# EAGLE design v1.3SMD (EAGLE 7.4.0)
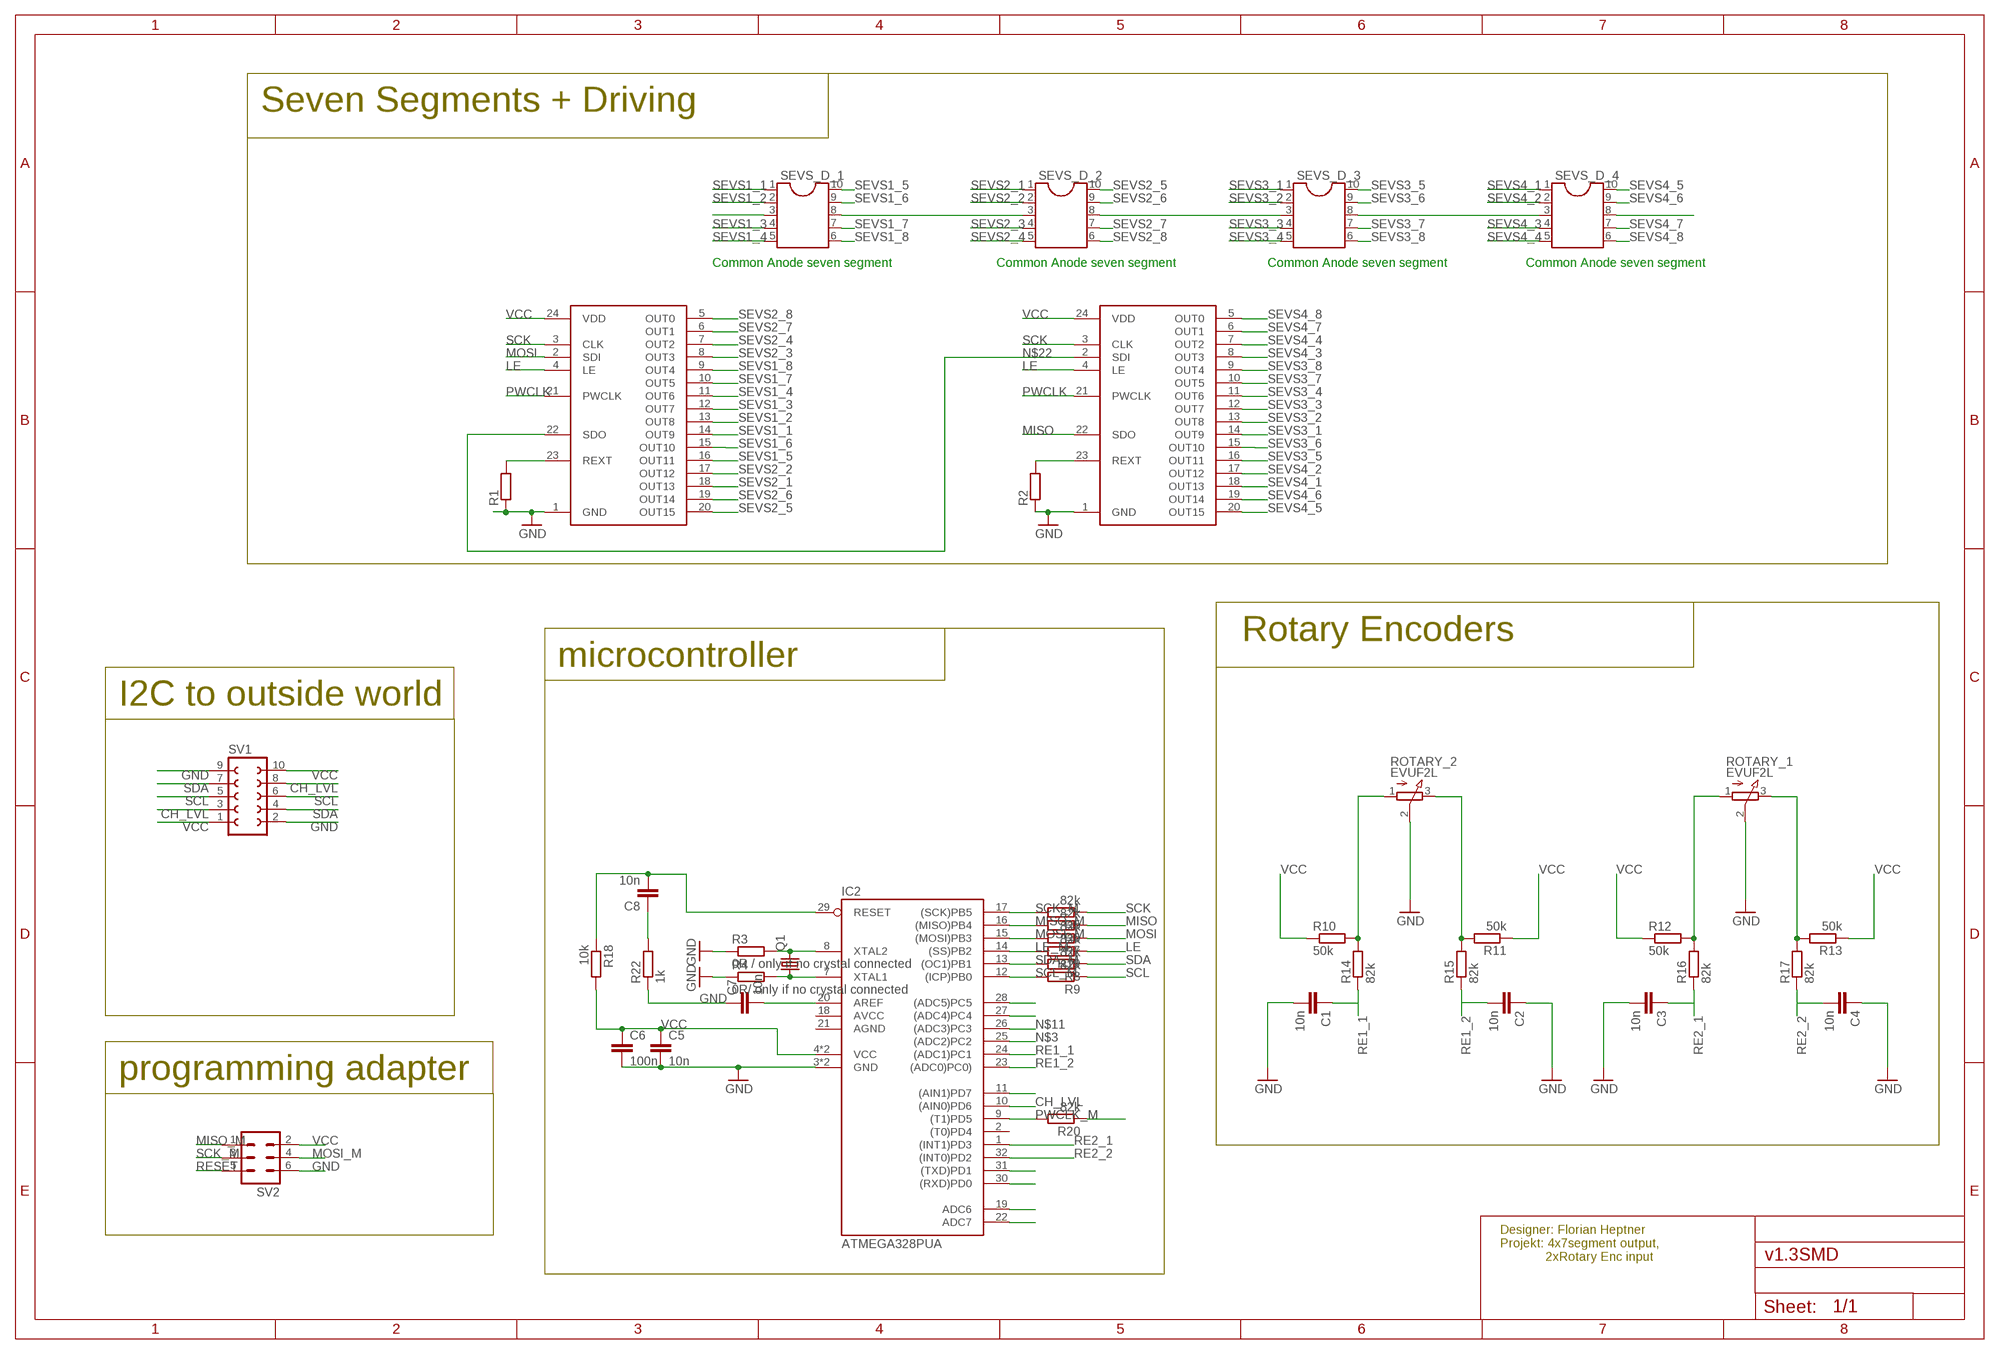
[diagram p0: schematic, sheet 1]

## Parts
C1  10n  C-EUC0603  [C0603]
C2  10n  C-EUC0603  [C0603]
C3  10n  C-EUC0603  [C0603]
C4  10n  C-EUC0603  [C0603]
C5  10n  C-EUC0603  [C0603]
C6  100n  C-EUC0603  [C0603]
C7  10n  C-EUC0603  [C0603]
C8  10n  C-EUC0603  [C0603]
IC2  ATMEGA328PUA  [TQFP32-08]
Q1  CRYSTALSM49  [SM49]
R1  R-EU_R0603  [R0603]
R2  R-EU_R0603  [R0603]
R3  0R / only if no crystal connected  R-EU_R0603  [R0603]
R4  0R/ only if no crystal connected  R-EU_R0603  [R0603]
R5  82k  R-EU_R0603  [R0603]
R6  82k  R-EU_R0603  [R0603]
R7  82k  R-EU_R0603  [R0603]
R8  82k  R-EU_R0603  [R0603]
R9  82k  R-EU_R0603  [R0603]
R10  50k  R-EU_R0603  [R0603]
R11  50k  R-EU_R0603  [R0603]
R12  50k  R-EU_R0603  [R0603]
R13  50k  R-EU_R0603  [R0603]
R14  82k  R-EU_R0603  [R0603]
R15  82k  R-EU_R0603  [R0603]
R16  82k  R-EU_R0603  [R0603]
R17  82k  R-EU_R0603  [R0603]
R18  10k  R-EU_R0603  [R0603]
R19  82k  R-EU_R0603  [R0603]
R20  82k  R-EU_R0603  [R0603]
R22  1k  R-EU_R0603  [R0603]
ROTARY_1  EVUF2L  [EVUFXL]
ROTARY_2  EVUF2L  [EVUFXL]
SEVS_D_1  DIL10  [DIL10]
SEVS_D_2  DIL10  [DIL10]
SEVS_D_3  DIL10  [DIL10]
SEVS_D_4  DIL10  [DIL10]
SV1  FE05-2  [FE05-2]
SV2  ML6  [ML6]
U$1  SPILEDDRIVER  [TSSOP24]
U$2  SPILEDDRIVER  [TSSOP24]

## Nets
CH_LVL: IC2.10((AIN0)PD6) SV1.3 SV1.8
GND: C1.2 C2.1 C3.2 C4.1 C5.2 C6.2 C7.1 IC2.3(GND) IC2.5(GND) R1.1 R2.1 R3.1 R4.1 R22.1 ROTARY_1.2(S) ROTARY_2.2(S) SV1.2 SV1.9 SV2.6 U$1.1(GND) U$2.1(GND)
LE: R19.1 U$1.4(LE) U$2.4(LE)
LE_M: IC2.14((SS)PB2) R19.2
MISO: R6.1 U$2.22(SDO)
MISO_M: IC2.16((MISO)PB4) R6.2 SV2.1
MOSI: R7.1 U$1.2(SDI)
MOSI_M: IC2.15((MOSI)PB3) R7.2 SV2.4
N$1: R11.2 R15.2 ROTARY_2.3(E)
N$2: C8.1 R22.2
N$3: IC2.25((ADC2)PC2)
N$4: R10.2 R14.2 ROTARY_2.1(A)
N$5: R12.2 R16.2 ROTARY_1.1(A)
N$6: R13.2 R17.2 ROTARY_1.3(E)
N$7: IC2.7(XTAL1) Q1.1 R4.2
N$8: IC2.8(XTAL2) Q1.2 R3.2
N$10: IC2.28((ADC5)PC5)
N$11: IC2.26((ADC3)PC3)
N$12: IC2.27((ADC4)PC4)
N$13: IC2.11((AIN1)PD7)
N$15: C7.2 IC2.20(AREF)
N$17: IC2.31((TXD)PD1)
N$18: IC2.30((RXD)PD0)
N$19: IC2.19(ADC6)
N$20: IC2.22(ADC7)
N$22: U$1.22(SDO) U$2.2(SDI)
N$42: R1.2 U$1.23(REXT)
N$44: R2.2 U$2.23(REXT)
PWCLK: R20.1 U$1.21(PWCLK) U$2.21(PWCLK)
PWCLK_M: IC2.9((T1)PD5) R20.2
RE1_1: C1.1 IC2.24((ADC1)PC1) R14.1
RE1_2: C2.2 IC2.23((ADC0)PC0)) R15.1
RE2_1: C3.1 IC2.1((INT1)PD3) R16.1
RE2_2: C4.2 IC2.32((INT0)PD2) R17.1
RESET: C8.2 IC2.29(RESET) R18.1 SV2.5
SCK: R5.1 U$1.3(CLK) U$2.3(CLK)
SCK_M: IC2.17((SCK)PB5) R5.2 SV2.3
SCL: R9.1 SV1.5 SV1.6
SCL_M: IC2.12((ICP)PB0) R9.2
SDA: R8.1 SV1.4 SV1.7
SDA_M: IC2.13((OC1)PB1) R8.2
SEVS1_1: SEVS_D_1.1 U$1.14(OUT9)
SEVS1_2: SEVS_D_1.2 U$1.13(OUT8)
SEVS1_3: SEVS_D_1.4 U$1.12(OUT7)
SEVS1_4: SEVS_D_1.5 U$1.11(OUT6)
SEVS1_5: SEVS_D_1.10 U$1.16(OUT11)
SEVS1_6: SEVS_D_1.9 U$1.15(OUT10)
SEVS1_7: SEVS_D_1.7 U$1.10(OUT5)
SEVS1_8: SEVS_D_1.6 U$1.9(OUT4)
SEVS2_1: SEVS_D_2.1 U$1.18(OUT13)
SEVS2_2: SEVS_D_2.2 U$1.17(OUT12)
SEVS2_3: SEVS_D_2.4 U$1.8(OUT3)
SEVS2_4: SEVS_D_2.5 U$1.7(OUT2)
SEVS2_5: SEVS_D_2.10 U$1.20(OUT15)
SEVS2_6: SEVS_D_2.9 U$1.19(OUT14)
SEVS2_7: SEVS_D_2.7 U$1.6(OUT1)
SEVS2_8: SEVS_D_2.6 U$1.5(OUT0)
SEVS3_1: SEVS_D_3.1 U$2.14(OUT9)
SEVS3_2: SEVS_D_3.2 U$2.13(OUT8)
SEVS3_3: SEVS_D_3.4 U$2.12(OUT7)
SEVS3_4: SEVS_D_3.5 U$2.11(OUT6)
SEVS3_5: SEVS_D_3.10 U$2.16(OUT11)
SEVS3_6: SEVS_D_3.9 U$2.15(OUT10)
SEVS3_7: SEVS_D_3.7 U$2.10(OUT5)
SEVS3_8: SEVS_D_3.6 U$2.9(OUT4)
SEVS4_1: SEVS_D_4.1 U$2.18(OUT13)
SEVS4_2: SEVS_D_4.2 U$2.17(OUT12)
SEVS4_3: SEVS_D_4.4 U$2.8(OUT3)
SEVS4_4: SEVS_D_4.5 U$2.7(OUT2)
SEVS4_5: SEVS_D_4.10 U$2.20(OUT15)
SEVS4_6: SEVS_D_4.9 U$2.19(OUT14)
SEVS4_7: SEVS_D_4.7 U$2.6(OUT1)
SEVS4_8: SEVS_D_4.6 U$2.5(OUT0)
VCC: C5.1 C6.1 IC2.4(VCC) IC2.6(VCC) R10.1 R11.1 R12.1 R13.1 R18.2 SEVS_D_1.3 SEVS_D_1.8 SEVS_D_2.3 SEVS_D_2.8 SEVS_D_3.3 SEVS_D_3.8 SEVS_D_4.3 SEVS_D_4.8 SV1.1 SV1.10 SV2.2 U$1.24(VDD) U$2.24(VDD)
Unconnected: IC2.2((T0)PD4)

## Notes on the sheet
- Seven Segments + Driving
- Common Anode seven segment | Common Anode seven segment | Common Anode seven segment | Common Anode seven segment
- Rotary Encoders
- microcontroller
- I2C to outside world
- programming adapter
- Designer: Florian Heptner
  Projekt: 4x7segment output,
               2xRotary Enc input

## Power pins joined to a net without a drawn wire
AGND: IC2.21(AGND)
AVCC: IC2.18(AVCC)

## Library data of the parts
C1-C8 = rcl:C-EU: CAPACITOR, European symbol
IC2 = atmel:ATMEGA328PU: MICROCONTROLLER 4 Kbytes FLASH 128 bytes SRAM 256 bytes EEPROM UART 6-channel 10 bit ADC; OC_FARNELL: unknown; OC_NEWARK: unknown
Q1 = crystal:CRYSTAL: CRYSTAL; OC_FARNELL: unknown; OC_NEWARK: unknown
R1-R20 R22 = rcl:R-EU_: RESISTOR, European symbol
ROTARY_1 ROTARY_2 = pot:EVU: 9 mm Square Rotary Potentiometers Source: Panasonic
SEVS_D_1-SEVS_D_4 = ic-package:DIL10: Dual In Line / Socket
SV1 = con-lsta:FE05-2: FEMALE HEADER; OC_FARNELL: unknown; OC_NEWARK: unknown
SV2 = con-harting-ml:ML6: HARTING; OC_FARNELL: unknown; OC_NEWARK: unknown
U$1 U$2 = spileddriver:SPILEDDRIVER

## Board
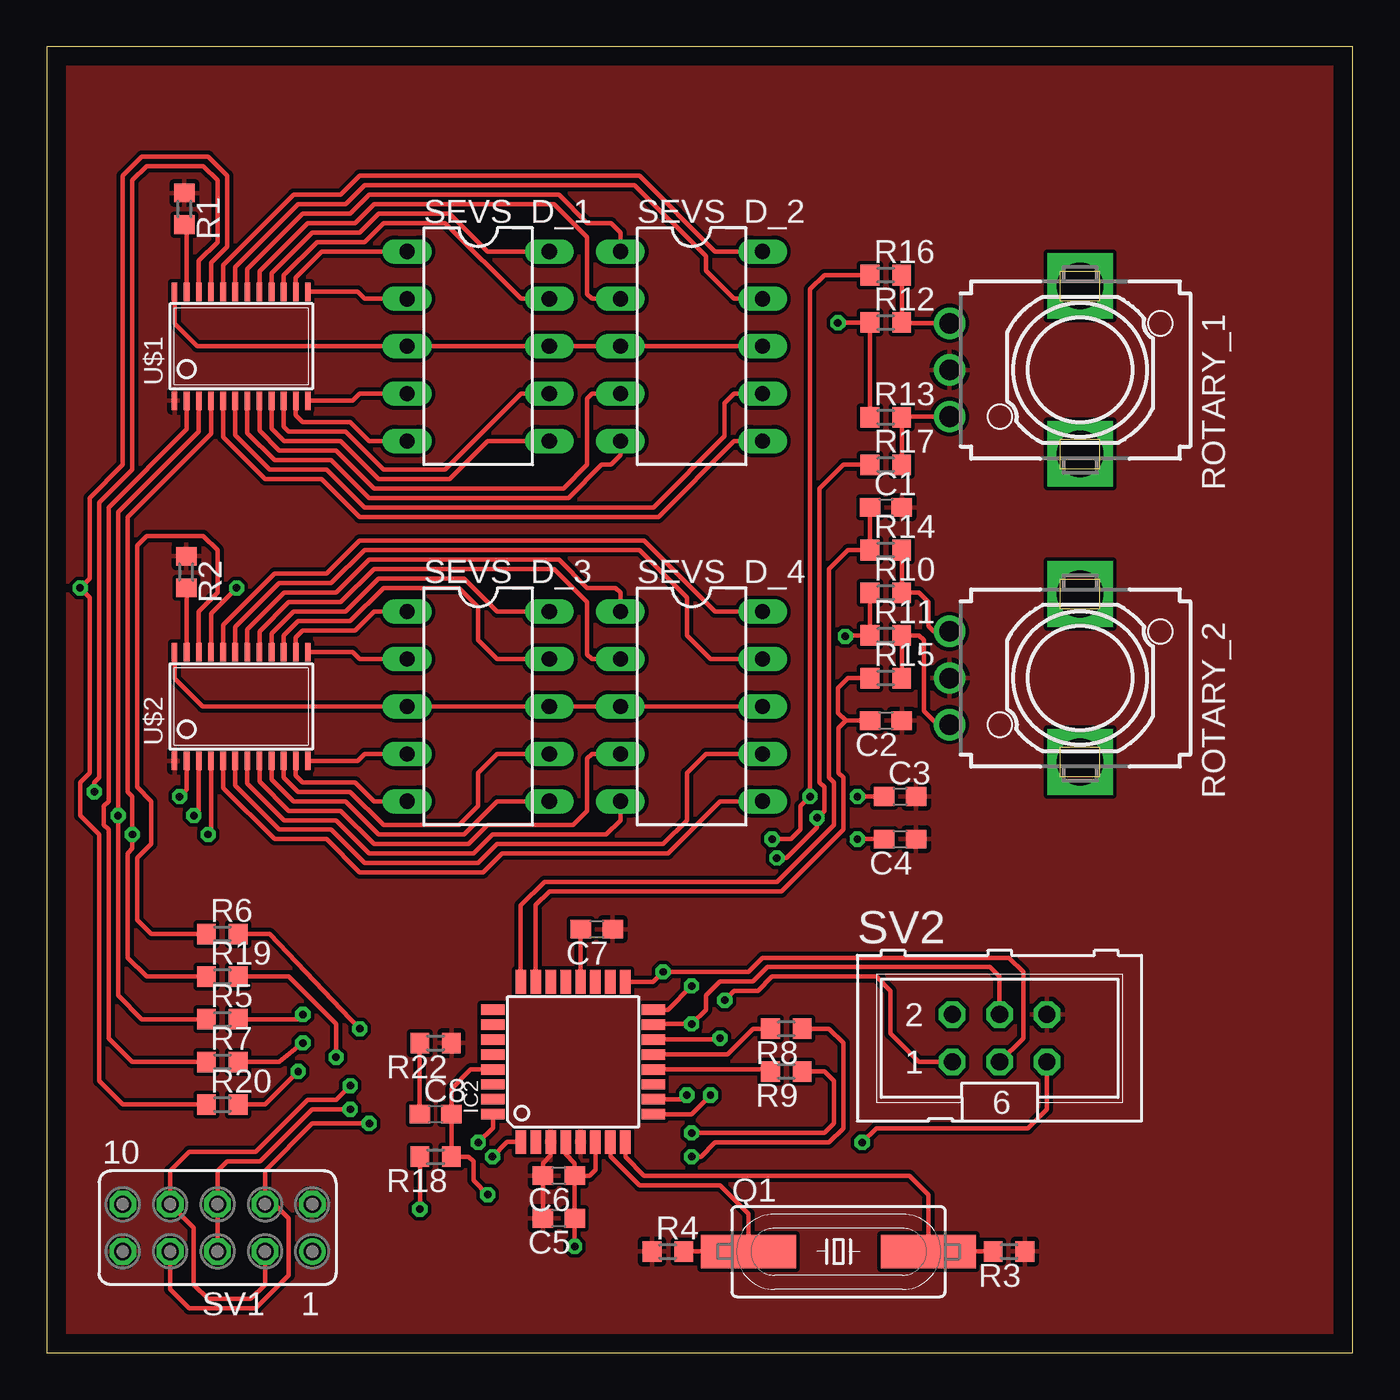
[diagram p1: board, top side]
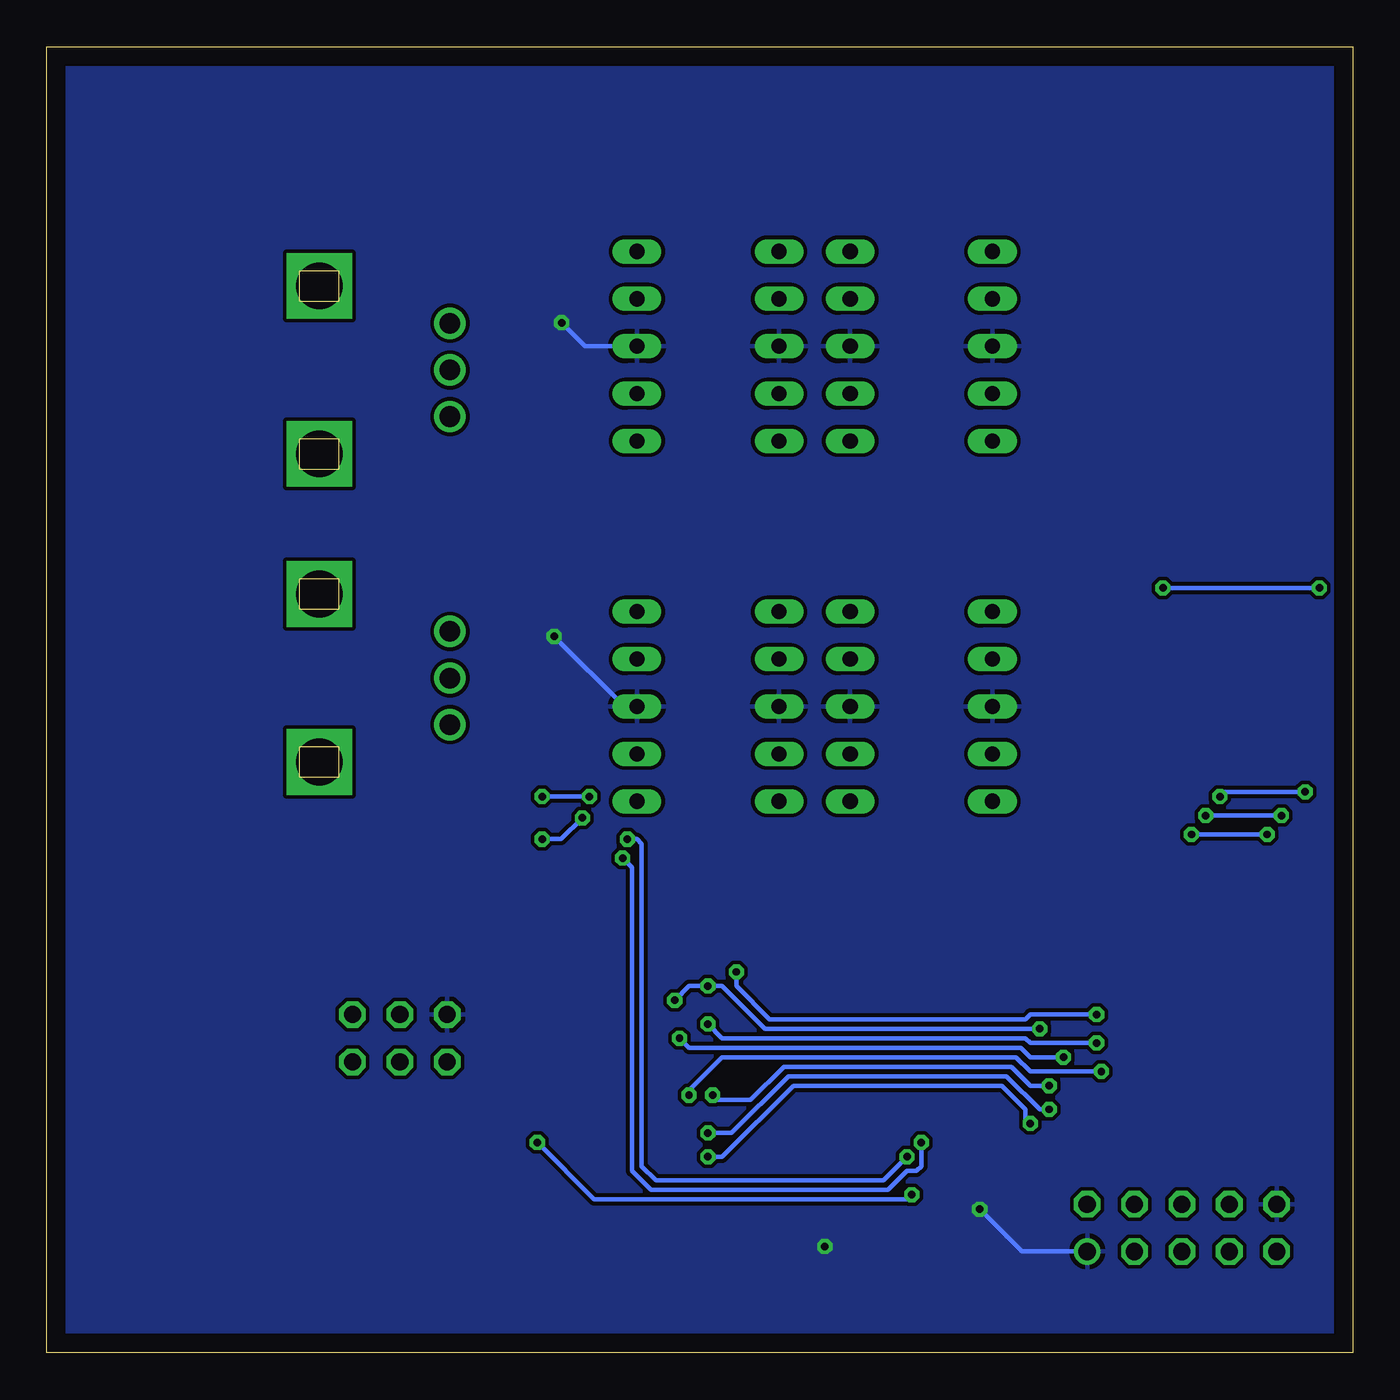
[diagram p2: board, bottom side, seen from below]

Size 70 x 70 mm. Coordinates in mm from the lower left corner, seen from the top.
Outline: 0,0 70,0 70,70 0,70 0,0
Copper layers (1*16): Top 0.035mm / dielectric 1.5mm / Bottom 0.035mm
Design rules "default *": minimum track width 10mil, minimum drill 0.3mm, track to track 8mil, track to pad 8mil, pad to pad 8mil, via to via 8mil, smd to smd 8mil, copper to edge 40mil, drill to drill 8mil, minimum pad ring 10mil, minimum via ring 8mil, stop-mask expansion 4mil, vias tented up to drill 0mil, thermal gap 10mil

### Footprints (pad centres in the part's own frame; a part is rotated, then mirrored left to right if it is on the bottom)
C0603 = smd 1.1 x 1: 1 -0.85,0; 2 0.85,0
TQFP32-08 = smd 1.27 x 0.559: 1 -4.293,2.8; 2 -4.293,2; 3 -4.293,1.2; 4 -4.293,0.4; 5 -4.293,-0.4; 6 -4.293,-1.2; 7 -4.293,-2; 8 -4.293,-2.8; 17 4.293,-2.8; 18 4.293,-2; 19 4.293,-1.2; 20 4.293,-0.4; 21 4.293,0.4; 22 4.293,1.2; 23 4.293,2; 24 4.293,2.8 | smd 0.559 x 1.27: 9 -2.8,-4.293; 10 -2,-4.293; 11 -1.2,-4.293; 12 -0.4,-4.293; 13 0.4,-4.293; 14 1.2,-4.293; 15 2,-4.293; 16 2.8,-4.293; 25 2.8,4.293; 26 2,4.293; 27 1.2,4.293; 28 0.4,4.293; 29 -0.4,4.293; 30 -1.2,4.293; 31 -2,4.293; 32 -2.8,4.293
SM49 = smd 5.08 x 1.778: 1 -4.826,0; 2 4.826,0
R0603 = smd 1 x 1.1: 1 -0.85,0; 2 0.85,0
EVUFXL = drill 1.1 pad 1.676: 1 -2.5,-7; 2 0,-7; 3 2.5,-7 | drill 2.5 pad 3.5 square: M1 4.5,0; M2 -4.5,0
DIL10 = drill 0.813 long: 1 -5.08,-3.81; 2 -2.54,-3.81; 3 0,-3.81; 4 2.54,-3.81; 5 5.08,-3.81; 6 5.08,3.81; 7 2.54,3.81; 8 0,3.81; 9 -2.54,3.81; 10 -5.08,3.81
FE05-2 = drill 0.914: 1 -5.08,1.27 | drill 0.914 octagon: 2 -5.08,-1.27; 3 -2.54,1.27; 4 -2.54,-1.27; 5 0,1.27; 6 0,-1.27; 7 2.54,1.27; 8 2.54,-1.27; 9 5.08,1.27; 10 5.08,-1.27
ML6 = drill 0.914 octagon: 1 -2.54,-1.27; 2 -2.54,1.27; 3 0,-1.27; 4 0,1.27; 5 2.54,-1.27; 6 2.54,1.27
TSSOP24 = smd 0.305 x 0.991: 1 -3.575,-2.918; 2 -2.925,-2.918; 3 -2.275,-2.918; 4 -1.625,-2.918; 5 -0.975,-2.918; 6 -0.325,-2.918; 7 0.325,-2.918; 8 0.975,-2.918; 9 1.625,-2.918; 10 2.275,-2.918; 11 2.925,-2.918; 12 3.575,-2.918; 13 3.575,2.918; 14 2.925,2.918; 15 2.275,2.918; 16 1.625,2.918; 17 0.975,2.918; 18 0.325,2.918; 19 -0.325,2.918; 20 -0.975,2.918; 21 -1.625,2.918; 22 -2.275,2.918; 23 -2.925,2.918; 24 -3.575,2.918

### Placement (x,y rotation side)
C1  44.97,45.31 0 top
C2  44.97,33.88 180 top
C3  45.74,29.81 0 top
C4  45.74,27.53 180 top
C5  27.45,7.21 180 top
C6  27.45,9.49 180 top
C7  29.48,22.7 180 top
C8  20.84,12.8 0 top
IC2  28.21,15.59 90 top
Q1  42.43,5.43 0 top
R1  7.38,61.31 270 top
R2  7.48,41.84 270 top
R3  51.58,5.43 180 top
R4  33.29,5.43 0 top
R5  9.41,17.88 0 top
R6  9.41,22.45 0 top
R7  9.41,15.59 0 top
R8  39.64,17.37 180 top
R9  39.64,15.08 180 top
R10  44.97,40.74 0 top
R11  44.97,38.45 0 top
R12  44.97,55.21 0 top
R13  44.97,50.13 0 top
R14  44.97,43.02 0 top
R15  44.97,36.16 0 top
R16  44.97,57.75 0 top
R17  44.97,47.59 0 top
R18  20.84,10.51 180 top
R19  9.41,20.16 0 top
R20  9.41,13.3 0 top
R22  20.84,16.61 180 top
ROTARY_1  55.39,52.67 270 top
ROTARY_2  55.39,36.16 270 top
SEVS_D_1  23.13,53.94 270 top
SEVS_D_2  34.56,53.94 270 top
SEVS_D_3  23.13,34.64 270 top
SEVS_D_4  34.56,34.64 270 top
SV1  9.16,6.7 180 top
SV2  51.07,16.86 0 top
U$1  10.43,53.94 0 top
U$2  10.43,34.64 0 top

### Tracks (layer width: path | path; a pad name or v marks a point on that pad's centre or on a via)
CH_LVL  (via drill 0.4)
  Top 0.254: SV1.3 11.7,3.65 10.94,2.89 8.65,2.89 7.89,3.65 7.89,6.7 SV1.8 6.62,9.75 7.64,10.76 11.19,10.76 13.99,13.56 15.51,13.56 v16.27,14.32 | v34.31,13.81 34.08,13.59 IC2.10
  Bottom 0.254: v16.27,14.32 17.29,14.32 18.3,15.34 30.5,15.34 32.27,13.56 34.05,13.56 v34.31,13.81
GND
  Top 0.254: IC2.3 27.01,10.58 26.6,10.17 C6.2 C5.2
  pour Top: 0,70 70,70 70,0 0,0
LE  (via drill 0.4)
  Top 0.254: U$2.4 8.8,27.93 v8.65,27.78 | U$1.4 8.8,49.27 4.33,44.8 4.33,30.07 4.59,29.81 v4.59,27.78 4.59,27.02 4.33,26.77 4.33,21.18 5.35,20.16 R19.1
  Bottom 0.254: v8.65,27.78 v4.59,27.78
LE_M  (via drill 0.4)
  Top 0.254: R19.2 12.97,20.16 15.51,17.62 v15.51,15.84 | v36.08,16.86 36.01,16.79 IC2.14
  Bottom 0.254: v15.51,15.84 17.29,15.84 17.8,16.35 35.58,16.35 v36.08,16.86
MISO
  Top 0.254: U$2.22 8.15,39.73 9.16,40.74 9.16,43.01 8.4,43.78 5.35,43.78 4.84,43.27 4.84,30.32 5.6,29.56 5.6,27.27 4.84,26.51 4.84,23.21 5.6,22.45 R6.1
MISO_M  (via drill 0.4)
  Top 0.254: R6.2 11.95,22.45 v16.78,17.37 | v34.56,19.65 33.3,18.39 IC2.16 | SV2.1 46.75,15.59 45.23,17.11 45.23,19.4 44.47,20.16 38.88,20.16 38.12,19.4 36.85,19.4 v36.34,18.89
  Bottom 0.254: v16.78,17.37 31.51,17.37 33.8,19.65 v34.56,19.65 35.58,19.65 v36.34,18.89
MOSI
  Top 0.254: U$1.2 7.5,49.49 3.32,45.31 3.32,29.56 3.06,29.31 3.06,28.29 3.32,28.04 3.32,16.86 4.59,15.59 R7.1
MOSI_M  (via drill 0.4)
  Top 0.254: R7.2 12.46,15.59 v13.73,16.61 | IC2.15 32.53,17.62 v34.56,17.62 35.32,18.38 35.32,19.15 36.08,19.91 37.86,19.91 38.62,20.67 50.56,20.67 51.07,20.16 SV2.4
  Bottom 0.254: v13.73,16.61 17.29,16.61 17.54,16.86 33.8,16.86 v34.56,17.62
N$1
  Top 0.254: R15.2 R11.2 46.75,38.45 47.01,38.2 47.01,34.39 47.73,33.66 ROTARY_2.3
N$2
  Top 0.254: C8.1 R22.2
N$4
  Top 0.254: R14.2 R10.2 46.75,40.74 47.26,40.23 47.26,38.96 47.55,38.66 ROTARY_2.1
N$5
  Top 0.254: R16.2 R12.2 45.86,55.17 ROTARY_1.1
N$6
  Top 0.254: R17.2 R13.2 45.86,50.17 ROTARY_1.3
N$7
  Top 0.254: IC2.7 30.21,10.54 31.77,8.99 36.08,8.99 37.61,7.46 Q1.1 R4.2
N$8
  Top 0.254: IC2.8 31.01,10.5 32.02,9.49 46.24,9.49 47.26,8.48 Q1.2 R3.2
N$15
  Top 0.254: IC2.20 28.61,22.68 C7.2
N$22  (via drill 0.4)
  Top 0.254: U$2.2 7.5,30.19 v7.13,29.81 | U$1.22 8.15,58.53 9.16,59.53 9.16,62.83 8.4,63.6 5.35,63.6 4.59,62.83 4.59,47.34 2.81,45.56 2.81,30.83 2.56,30.58 v2.56,30.07
  Bottom 0.254: v7.13,29.81 6.87,30.07 v2.56,30.07
N$42
  Top 0.254: U$1.23 7.5,60.34 R1.2
N$44
  Top 0.254: U$2.23 7.5,40.27 R2.2
PWCLK  (via drill 0.4)
  Top 0.254: U$2.21 8.8,39.62 v10.18,40.99 | U$1.21 8.8,58.41 9.67,59.28 9.67,63.09 8.65,64.1 5.1,64.1 4.08,63.09 4.08,47.59 2.3,45.82 2.3,41.5 v1.79,40.99 2.3,40.48 2.3,31.08 1.79,30.58 1.79,28.8 2.81,27.78 2.81,14.57 4.08,13.3 R20.1
  Bottom 0.254: v10.18,40.99 v1.79,40.99
PWCLK_M  (via drill 0.4)
  Top 0.254: R20.2 11.7,13.3 v13.48,15.08 | IC2.9 34.55,12.79 v35.58,13.81
  Bottom 0.254: v13.48,15.08 17.29,15.08 18.05,15.84 33.8,15.84 35.58,14.07 v35.58,13.81
RE1_1
  Top 0.254: C1.1 R14.1 42.94,43.02 41.93,42.01 41.93,30.83 42.18,30.58 42.18,28.29 39.13,25.24 26.69,25.24 25.41,23.97 IC2.24
RE1_2
  Top 0.254: R15.1 42.94,36.16 42.42,35.64 42.42,34.29 42.83,33.88 | IC2.23 26.21,24 26.94,24.73 39.39,24.73 42.69,28.04 42.69,30.83 42.43,31.08 42.43,33.48 42.83,33.88 | C2.2 42.83,33.88
RE2_1  (via drill 0.4)
  Top 0.254: R16.1 41.67,57.75 40.91,56.99 v40.91,29.81 40.4,29.31 40.4,28.04 39.89,27.53 v38.88,27.53 | C3.1 v43.45,29.81 | v23.89,10.51 24.68,11.3 IC2.1
  Bottom 0.254: v40.91,29.81 v43.45,29.81 | v38.88,27.53 38.37,27.53 38.12,27.27 38.12,10 37.35,9.24 25.16,9.24 v23.89,10.51
RE2_2  (via drill 0.4)
  Top 0.254: R17.1 42.69,47.59 41.42,46.32 41.42,30.58 41.67,30.32 41.67,29.05 v41.29,28.67 41.29,28.16 39.64,26.51 v39.13,26.51 | C4.2 v43.45,27.53 | v23.13,11.27 23.92,12.06 IC2.32
  Bottom 0.254: v43.45,27.53 42.43,27.53 v41.29,28.67 | v39.13,26.51 38.62,26 38.62,9.75 37.61,8.73 24.91,8.73 23.89,9.75 23.38,9.75 23.13,10 v23.13,11.27
RESET  (via drill 0.4)
  Top 0.254: SV2.5 53.61,13.05 52.59,12.03 44.47,12.03 v43.7,11.27 | v23.64,8.48 22.88,9.24 22.88,10.26 22.62,10.51 R18.1 C8.2 21.69,14.15 22.73,15.19 IC2.29
  Bottom 0.254: v43.7,11.27 40.66,8.22 23.89,8.22 v23.64,8.48
SCK  (via drill 0.4)
  Top 0.254: U$2.3 8.15,29.06 v7.89,28.8 | U$1.3 8.15,49.38 3.83,45.05 v3.83,28.8 3.83,19.15 5.1,17.88 R5.1
  Bottom 0.254: v7.89,28.8 v3.83,28.8
SCK_M  (via drill 0.4)
  Top 0.254: R5.2 13.48,17.88 v13.73,18.13 | IC2.17 32.5,19.88 v33.04,20.42 37.61,20.42 38.37,21.18 51.58,21.18 52.34,20.42 52.34,16.86 SV2.3
  Bottom 0.254: v13.73,18.13 17.29,18.13 17.54,17.88 31.26,17.88 33.04,19.65 v33.04,20.42
SCL  (via drill 0.4)
  Top 0.254: SV1.5 SV1.6 9.16,9.75 9.67,10.26 11.45,10.26 14.24,13.05 v16.27,13.05 | R9.1 41.67,15.08 42.18,14.57 42.18,12.29 41.67,11.78 v34.56,11.78
  Bottom 0.254: v16.27,13.05 16.78,13.05 18.56,14.83 30.24,14.83 33.29,11.78 v34.56,11.78
SCL_M
  Top 0.254: IC2.12 38.68,15.19 R9.2
SDA  (via drill 0.4)
  Top 0.254: R8.1 41.93,17.37 42.69,16.61 42.69,12.03 41.93,11.27 35.83,11.27 35.07,10.51 v34.56,10.51 | SV1.7 6.62,3.4 7.64,2.38 11.19,2.38 12.97,4.16 12.97,7.21 12.21,7.97 SV1.4 11.7,9.75 14.24,12.29 v17.29,12.29
  Bottom 0.254: v17.29,12.29 17.54,12.54 17.54,13.05 18.81,14.32 29.99,14.32 33.8,10.51 v34.56,10.51
SDA_M
  Top 0.254: IC2.13 36.48,15.99 37.86,17.37 R8.2
SEVS1_1
  Top 0.254: U$1.14 13.36,57.63 14.75,59.02 SEVS_D_1.1
SEVS1_2
  Top 0.254: U$1.13 16.66,56.86 17.03,56.48 SEVS_D_1.2
SEVS1_3
  Top 0.254: U$1.12 16.4,51.03 16.78,51.4 SEVS_D_1.4
SEVS1_4
  Top 0.254: U$1.11 13.36,50.26 13.73,49.88 16.27,49.88 17.29,48.86 SEVS_D_1.5
SEVS1_5
  Top 0.254: U$1.16 12.05,57.85 14.24,60.04 16.78,60.04 17.8,61.06 21.61,61.06 23.64,59.02 SEVS_D_1.10
SEVS1_6
  Top 0.254: U$1.15 12.71,57.74 14.49,59.53 17.03,59.53 18.05,60.55 21.35,60.55 25.42,56.48 SEVS_D_1.9
SEVS1_7
  Top 0.254: U$1.10 12.71,49.64 12.97,49.37 16.02,49.37 18.05,47.34 21.35,47.34 25.42,51.4 SEVS_D_1.7
SEVS1_8
  Top 0.254: U$1.9 12.05,49.52 12.72,48.86 15.76,48.86 17.8,46.83 21.61,46.83 23.64,48.86 SEVS_D_1.6
SEVS2_1
  Top 0.254: U$1.18 10.76,58.08 13.73,61.06 16.27,61.06 17.29,62.07 27.45,62.07 28.97,60.55 30.24,60.55 30.75,60.04 SEVS_D_2.1
SEVS2_2
  Top 0.254: U$1.17 11.4,57.97 13.99,60.55 16.53,60.55 17.54,61.56 27.19,61.56 28.97,59.79 28.97,56.74 29.23,56.48 SEVS_D_2.2
SEVS2_3
  Top 0.254: U$1.8 11.4,49.41 12.46,48.36 15.51,48.36 17.54,46.32 27.7,46.32 28.97,47.59 28.97,51.15 29.23,51.4 SEVS_D_2.4
SEVS2_4
  Top 0.254: U$1.7 10.76,49.3 12.21,47.85 15.26,47.85 17.29,45.82 27.96,45.82 29.73,47.59 30.24,47.59 30.75,48.1 SEVS_D_2.5
SEVS2_5
  Top 0.254: U$1.20 9.46,58.3 13.22,62.07 15.76,62.07 16.78,63.09 31.77,63.09 35.83,59.02 SEVS_D_2.10
SEVS2_6
  Top 0.254: U$1.19 10.11,58.19 13.48,61.56 16.02,61.56 17.03,62.58 31.51,62.58 35.32,58.77 35.32,58.01 36.85,56.48 SEVS_D_2.9
SEVS2_7
  Top 0.254: U$1.6 10.11,49.19 11.95,47.34 15,47.34 17.03,45.31 32.53,45.31 36.34,49.12 36.34,50.9 36.85,51.4 SEVS_D_2.7
SEVS2_8
  Top 0.254: U$1.5 9.46,49.08 11.7,46.83 14.75,46.83 16.78,44.8 32.78,44.8 36.85,48.86 SEVS_D_2.6
SEVS3_1
  Top 0.254: U$2.14 13.36,38.33 13.73,38.7 16.53,38.7 17.54,39.72 SEVS_D_3.1
SEVS3_2
  Top 0.254: U$2.13 16.4,37.56 16.78,37.18 SEVS_D_3.2
SEVS3_3
  Top 0.254: SEVS_D_3.4 17.03,32.1 16.66,31.72 U$2.12
SEVS3_4
  Top 0.254: SEVS_D_3.5 17.54,29.56 16.53,30.58 13.73,30.58 13.36,30.95 U$2.11
SEVS3_5
  Top 0.254: U$2.16 12.05,38.55 13.22,39.72 16.02,39.72 17.8,41.5 22.37,41.5 24.15,39.72 SEVS_D_3.10
SEVS3_6
  Top 0.254: U$2.15 12.71,38.44 13.48,39.21 16.27,39.21 18.05,40.99 22.11,40.99 23.13,39.97 23.13,38.2 24.15,37.18 SEVS_D_3.9
SEVS3_7
  Top 0.254: SEVS_D_3.7 24.15,32.1 23.13,31.08 23.13,29.31 22.11,28.29 18.05,28.29 16.27,30.07 13.48,30.07 12.71,30.84 U$2.10
SEVS3_8
  Top 0.254: SEVS_D_3.6 24.15,29.56 22.37,27.78 17.8,27.78 16.02,29.56 13.22,29.56 12.05,30.73 U$2.9
SEVS4_1
  Top 0.254: U$2.18 10.76,38.77 12.72,40.74 15.51,40.74 17.29,42.51 27.45,42.51 28.97,40.99 30.5,40.99 30.75,40.74 SEVS_D_4.1
SEVS4_2
  Top 0.254: U$2.17 11.4,38.66 12.97,40.23 15.76,40.23 17.54,42.01 27.19,42.01 28.97,40.23 28.97,37.43 29.23,37.18 SEVS_D_4.2
SEVS4_3
  Top 0.254: SEVS_D_4.4 29.23,32.1 28.97,31.85 28.97,29.05 28.21,28.29 23.64,28.29 22.62,27.27 17.54,27.27 15.76,29.05 12.97,29.05 11.4,30.62 U$2.8
SEVS4_4
  Top 0.254: SEVS_D_4.5 30.75,28.54 29.99,27.78 23.89,27.78 22.88,26.77 17.29,26.77 15.51,28.54 12.72,28.54 10.76,30.5 U$2.7
SEVS4_5
  Top 0.254: U$2.20 9.46,39 12.21,41.75 15,41.75 16.78,43.53 32.02,43.53 35.83,39.72 SEVS_D_4.10
SEVS4_6
  Top 0.254: U$2.19 10.11,38.89 12.46,41.24 15.26,41.24 17.03,43.02 31.77,43.02 34.31,40.48 34.31,38.45 35.58,37.18 SEVS_D_4.9
SEVS4_7
  Top 0.254: SEVS_D_4.7 35.32,32.1 34.31,31.08 34.31,28.54 33.04,27.27 24.15,27.27 23.13,26.26 17.03,26.26 15.26,28.04 12.46,28.04 10.11,30.39 U$2.6
SEVS4_8
  Top 0.254: SEVS_D_4.6 36.08,29.56 33.29,26.77 24.4,26.77 23.38,25.75 16.78,25.75 15,27.53 12.21,27.53 9.46,30.28 U$2.5
VCC  (via drill 0.4)
  Top 0.254: R13.1 R12.1 v42.4,55.2 | R10.1 R11.1 42.85,38.45 v42.8,38.4 | IC2.4 27.81,10.66 28.3,10.17 C6.1 | C6.1 C5.1 28.3,5.8 v28.3,5.7 | U$1.24 6.86,55.15 8.06,53.94 SEVS_D_1.3 | SEVS_D_2.8 19.24,53.94 19.2,53.9 | U$2.24 6.86,36.15 8.36,34.64 SEVS_D_3.3 SEVS_D_4.8 | v20,7.7 R18.2 | IC2.6 29.41,9.81 29.1,9.5 C6.1
  Bottom 0.254: SEVS_D_2.8 41.14,53.94 v42.4,55.2 | v42.8,38.4 39.04,34.64 SEVS_D_4.8 | SV1.1 17.73,5.43 v20,7.7
  pour Bottom: 0,70 70,70 70,0 0,0